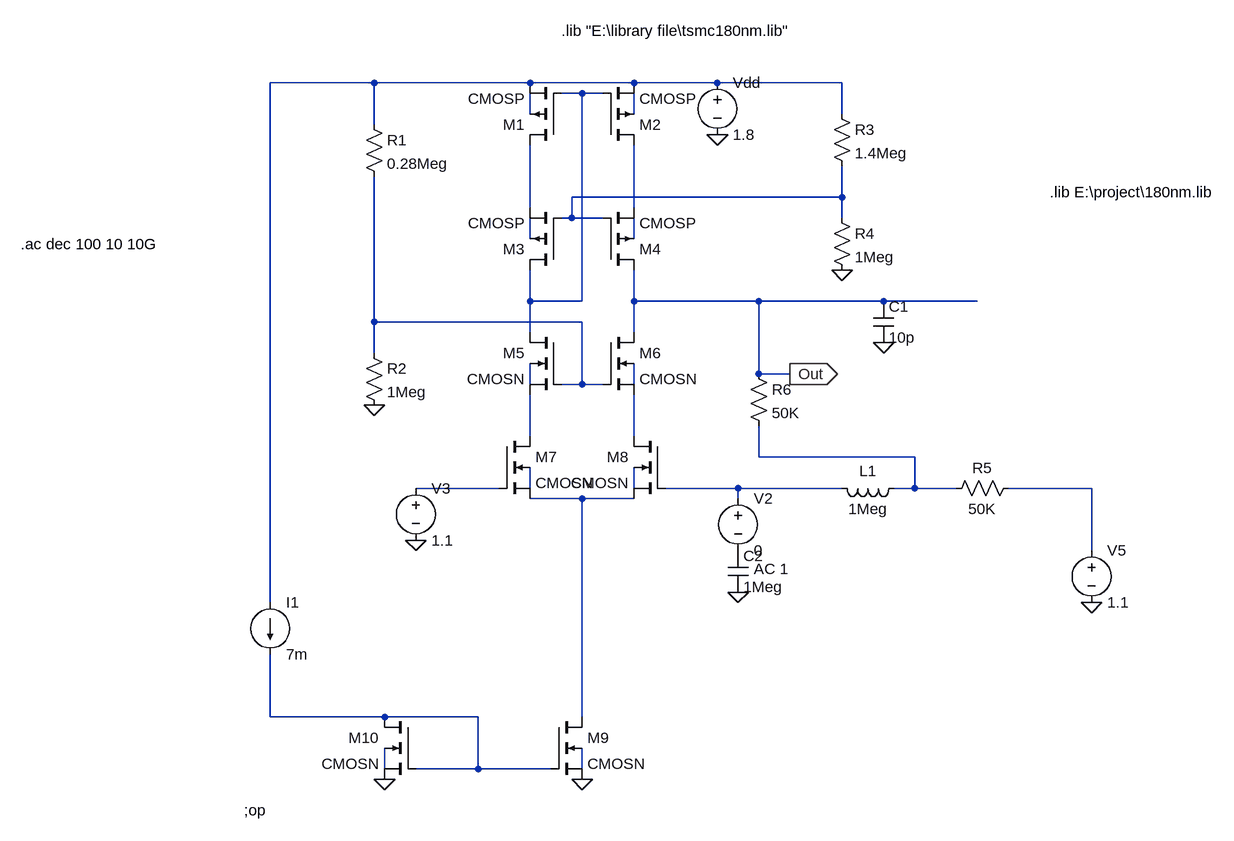
[diagram p0: schematic with Inductor_Single_stage.asc]
with Inductor_Single_stage.asc, the LTspice schematic file:
Version 4
SHEET 1 1384 1264
WIRE -208 128 -368 128
WIRE 32 128 -208 128
WIRE 192 128 32 128
WIRE 320 128 192 128
WIRE 512 128 320 128
WIRE 112 144 80 144
WIRE 144 144 112 144
WIRE 32 176 32 144
WIRE 192 176 192 144
WIRE 512 176 512 128
WIRE -208 192 -208 128
WIRE 512 304 512 256
WIRE 512 304 96 304
WIRE 32 320 32 224
WIRE 192 320 192 224
WIRE 96 336 96 304
WIRE 96 336 80 336
WIRE 144 336 96 336
WIRE 512 336 512 304
WIRE 32 368 32 336
WIRE 192 368 192 336
WIRE 32 464 32 416
WIRE 112 464 112 144
WIRE 112 464 32 464
WIRE 192 464 192 416
WIRE 384 464 192 464
WIRE 576 464 384 464
WIRE 720 464 576 464
WIRE -208 496 -208 272
WIRE 112 496 -208 496
WIRE 32 512 32 464
WIRE 192 512 192 464
WIRE -208 544 -208 496
WIRE 384 576 384 464
WIRE 432 576 384 576
WIRE 32 592 32 560
WIRE 112 592 112 496
WIRE 112 592 80 592
WIRE 144 592 112 592
WIRE 192 592 192 560
WIRE 32 672 32 608
WIRE 192 672 192 608
WIRE 384 704 384 656
WIRE 624 704 384 704
WIRE -16 752 -144 752
WIRE 32 752 32 720
WIRE 192 752 192 720
WIRE 352 752 240 752
WIRE 512 752 352 752
WIRE 624 752 624 704
WIRE 624 752 592 752
WIRE 688 752 624 752
WIRE 896 752 768 752
WIRE 112 768 32 768
WIRE 192 768 112 768
WIRE 352 768 352 752
WIRE 896 848 896 752
WIRE -368 928 -368 128
WIRE -368 1104 -368 1008
WIRE -192 1104 -368 1104
WIRE -48 1104 -192 1104
WIRE 112 1104 112 768
WIRE -192 1184 -192 1152
WIRE -48 1184 -48 1104
WIRE -48 1184 -144 1184
WIRE 64 1184 -48 1184
WIRE 112 1184 112 1152
FLAG 320 208 0
FLAG -192 1200 0
FLAG 112 1200 0
FLAG 512 416 0
FLAG -208 624 0
FLAG 432 576 Out
IOPIN 432 576 Out
FLAG 576 528 0
FLAG 896 928 0
FLAG 352 912 0
FLAG -144 832 0
DATAFLAG 384 464 ""
SYMBOL voltage 320 112 R0
WINDOW 123 0 0 Left 0
WINDOW 39 24 124 Left 2
SYMATTR InstName Vdd
SYMATTR Value 1.8
SYMBOL pmos4 80 416 R180
SYMATTR InstName M3
SYMATTR Value CMOSP
SYMATTR Value2 l=1u w=2300u
SYMBOL pmos4 144 416 M180
SYMATTR InstName M4
SYMATTR Value CMOSP
SYMATTR Value2 l=1u w=2300u
SYMBOL nmos4 80 512 M0
SYMATTR InstName M5
SYMATTR Value CMOSN
SYMATTR Value2 l=1u w=1000u
SYMBOL nmos4 144 512 R0
SYMATTR InstName M6
SYMATTR Value CMOSN
SYMATTR Value2 l=1u w=2300u
SYMBOL nmos4 240 672 M0
SYMATTR InstName M8
SYMATTR Value CMOSN
SYMATTR Value2 l=1u w=1000u
SYMBOL nmos4 -16 672 R0
SYMATTR InstName M7
SYMATTR Value CMOSN
SYMATTR Value2 l=1u w=1000u
SYMBOL voltage 352 752 R0
WINDOW 123 24 124 Left 2
WINDOW 39 24 124 Left 2
SYMATTR Value2 AC 1
SYMATTR InstName V2
SYMATTR Value 0
SYMBOL nmos4 64 1104 R0
SYMATTR InstName M9
SYMATTR Value CMOSN
SYMATTR Value2 l=1u w=1000u
SYMBOL nmos4 -144 1104 M0
SYMATTR InstName M10
SYMATTR Value CMOSN
SYMATTR Value2 l=1u w=1000u
SYMBOL current -368 928 R0
WINDOW 123 0 0 Left 0
WINDOW 39 0 0 Left 0
SYMATTR InstName I1
SYMATTR Value 7m
SYMBOL pmos4 80 224 R180
SYMATTR InstName M1
SYMATTR Value CMOSP
SYMATTR Value2 l=1u w=2300u
SYMBOL pmos4 144 224 M180
SYMATTR InstName M2
SYMATTR Value CMOSP
SYMATTR Value2 l=1u w=2300u
SYMBOL res -224 176 R0
SYMATTR InstName R1
SYMATTR Value 0.28Meg
SYMBOL res -224 528 R0
SYMATTR InstName R2
SYMATTR Value 1Meg
SYMBOL res 496 160 R0
SYMATTR InstName R3
SYMATTR Value 1.4Meg
SYMBOL res 496 320 R0
SYMATTR InstName R4
SYMATTR Value 1Meg
SYMBOL voltage -144 736 R0
WINDOW 123 0 0 Left 0
WINDOW 39 0 0 Left 0
SYMATTR InstName V3
SYMATTR Value 1.1
SYMBOL cap 560 464 R0
SYMATTR InstName C1
SYMATTR Value 10p
SYMBOL ind 608 736 R90
WINDOW 0 5 56 VBottom 2
WINDOW 3 32 56 VTop 2
SYMATTR InstName L1
SYMATTR Value 1Meg
SYMBOL res 784 736 R90
WINDOW 0 0 56 VBottom 2
WINDOW 3 32 56 VTop 2
SYMATTR InstName R5
SYMATTR Value 50K
SYMBOL voltage 896 832 R0
WINDOW 123 0 0 Left 0
WINDOW 39 0 0 Left 0
SYMATTR InstName V5
SYMATTR Value 1.1
SYMBOL cap 336 848 R0
SYMATTR InstName C2
SYMATTR Value 1Meg
SYMBOL res 368 560 R0
SYMATTR InstName R6
SYMATTR Value 50K
TEXT 80 48 Left 2 !.lib "E:\\library file\\tsmc180nm.lib"
TEXT -408 1248 Left 2 !;op
TEXT -752 376 Left 2 !.ac dec 100 10 10G
TEXT 832 296 Left 2 !.lib E:\\project\\180nm.lib

The netlist it stands for:
* with Inductor_Single_stage.asc
Vdd N001 0 1.8
M3 N002 N005 N006 N008 CMOSP l=1u w=2300u
M4 Out N005 N007 N009 CMOSP l=1u w=2300u
M5 N002 N010 N013 N011 CMOSN l=1u w=1000u
M6 Out N010 N014 N012 CMOSN l=1u w=2300u
M8 N014 N019 N021 N018 CMOSN l=1u w=1000u
M7 N013 N016 N021 N017 CMOSN l=1u w=1000u
V2 N019 P001 0 AC 1
M9 N021 N022 0 N024 CMOSN l=1u w=1000u
M10 N022 N022 0 N023 CMOSN l=1u w=1000u
I1 N001 N022 7m
M1 N006 N002 N001 N003 CMOSP l=1u w=2300u
M2 N007 N002 N001 N004 CMOSP l=1u w=2300u
R1 N001 N010 0.28Meg
R2 N010 0 1Meg
R3 N001 N005 1.4Meg
R4 N005 0 1Meg
V3 N016 0 1.1
C1 Out 0 10p
L1 N015 N019 1Meg
R5 N020 N015 50K
V5 N020 0 1.1
C2 P001 0 1Meg
R6 Out N015 50K
.model NMOS NMOS
.model PMOS PMOS
.lib standard.mos
.lib "E:\library file\tsmc180nm.lib"
;op
.ac dec 100 10 10G
.lib E:\project\180nm.lib
.backanno
.end